# EAGLE design EtnaNode0.2 (EAGLE 7.2.0)
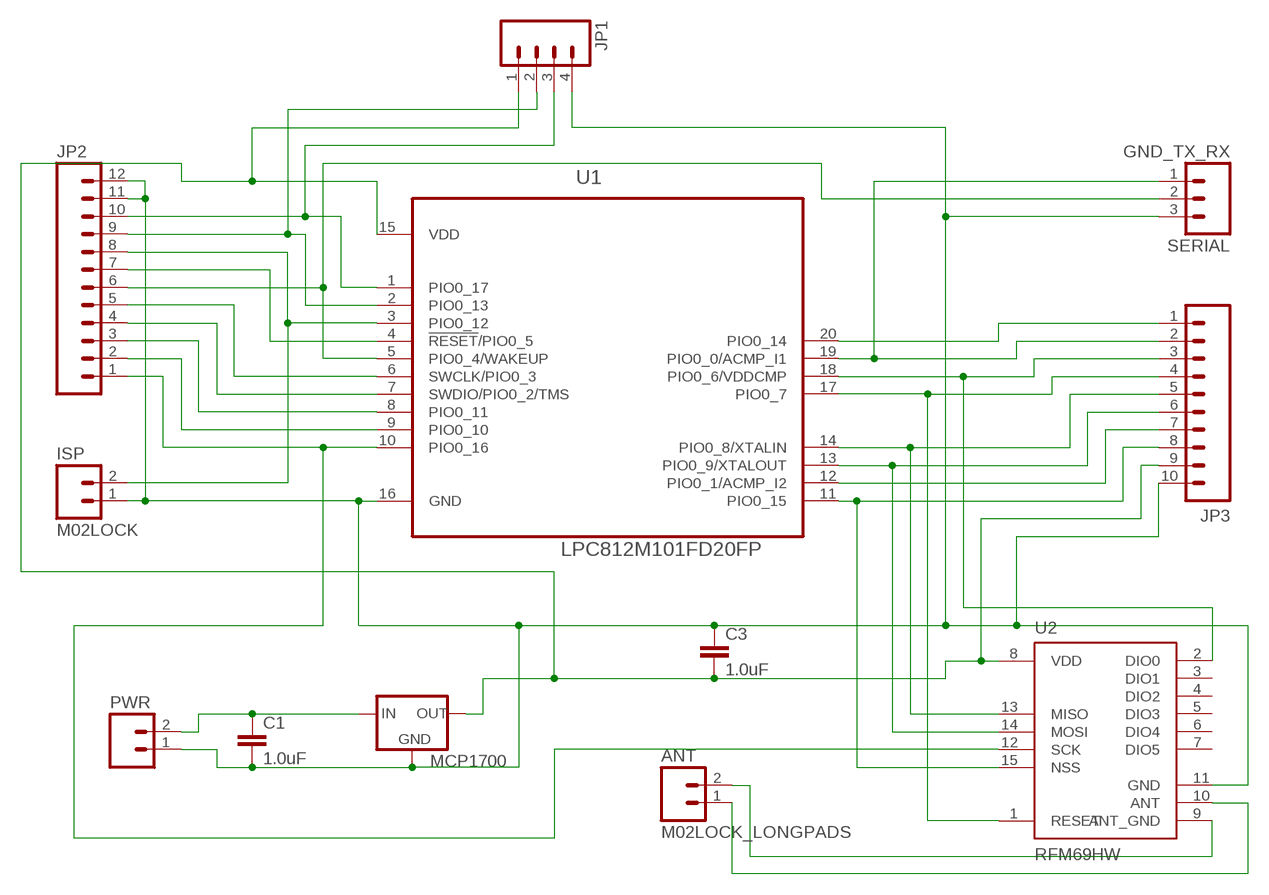
[diagram p0: schematic, sheet 1]

## Parts
ANT  M02LOCK_LONGPADS  [1X02_LOCK_LONGPADS]
C1  1.0uF  CAPPTH  [CAP-PTH-SMALL]
C3  1.0uF  CAPPTH  [CAP-PTH-SMALL]
ISP  M02LOCK  [1X02_LOCK]
JP1  M04LOCK  [1X04_LOCK]
JP2  M12LOCK  [1X12_LOCK]
JP3  M10LOCK  [1X10_LOCK]
MCP1700  MCP1700INLINE  [TO92-INLINE]
PWR  M02LOCK_LONGPADS  [1X02_LOCK_LONGPADS]
SERIAL  GND_TX_RX  M03LOCK  [1X03_LOCK]
U1  LPC812M101FD20FP  [SOIC127P1032X265-20N]
U2  RFM69HW  [RFM69W-XXXS2]

## Nets
ANT_GND: ANT.2 U2.9(ANT_GND)
GND: C1.2 C3.1 ISP.1 JP1.4 JP2.11 JP2.12(VCC) JP3.10 MCP1700.1(GND) PWR.1 SERIAL.3(U0_RXD) U1.16(GND) U2.11(GND)
N$1: C1.1 MCP1700.2(IN) PWR.2
N$4: JP3.2 SERIAL.1(GND) U1.19(PIO0_0/ACMP_I1)
N$5: JP2.6 SERIAL.2(U0_TXD) U1.5(PIO0_4/WAKEUP)
N$6: ISP.2 JP2.8 U1.3(PIO0_12)
N$7: JP3.5 U1.14(PIO0_8/XTALIN) U2.13(MISO)
N$8: JP3.6 U1.13(PIO0_9/XTALOUT) U2.14(MOSI)
N$9: JP3.7 U1.12(PIO0_1/ACMP_I2)
N$10: JP3.8 U1.11(PIO0_15) U2.15(NSS)
N$11: JP3.4 U1.17(PIO0_7) U2.1(RESET)
N$12: JP3.3 U1.18(PIO0_6/VDDCMP) U2.2(DIO0)
N$14: JP2.2 U1.9(PIO0_10)
N$15: JP2.3 U1.8(PIO0_11)
N$16: JP2.4 U1.7(SWDIO/PIO0_2/TMS)
N$17: JP2.5 U1.6(SWCLK/PIO0_3)
N$18: JP2.7 U1.4(!RESET!/PIO0_5)
N$19: JP1.2 JP2.9 U1.2(PIO0_13)
N$20: JP1.3 JP2.10 U1.1(PIO0_17)
N$21: JP3.1 U1.20(PIO0_14)
N$22: ANT.1 U2.10(ANT)
N$23: JP2.1 U1.10(PIO0_16) U2.12(SCK)
VDD: C3.2 JP1.1 JP3.9 MCP1700.3(OUT) U1.15(VDD) U2.8(VDD)
Unconnected: U2.3(DIO1) U2.4(DIO2) U2.5(DIO3) U2.6(DIO4) U2.7(DIO5)

## Library data of the parts
ANT ISP PWR = SparkFun-Connectors:M02: Standard 2-pin 0.1" header. Use with - straight break away headers ( PRT-00116) - right angle break away headers (PRT-00553) - swiss pins (PRT-00743) - machine pins (PRT-00117) - female headers (PRT-00115) Molex polarized connector foot print use with: PRT-08233 with associated crimp pins and housings. 2.54_SCREWTERM for use with PRT-10571. 3.5mm Screw Terminal footprints for PRT-08084 5mm Screw Terminal footprints for use with PRT-08432
C1 C3 = SparkFun-Capacitors:CAP: Capacitor Standard 0603 ceramic capacitor, and 0.1" leaded capacitor.
JP1 = SparkFun-Connectors:M04: Header 4 Standard 4-pin 0.1" header. Use with straight break away headers (SKU : PRT-00116), right angle break away headers (PRT-00553), swiss pins (PRT-00743), machine pins (PRT-00117), and female headers (PRT-00115). Molex polarized connector foot print use with SKU : PRT-08231 with associated crimp pins and housings. 1MM SMD Version SKU: PRT-10208
JP2 = SparkFun-Connectors:M12: Header 12 Standard 12-pin 0.1" header. Use with straight break away headers (SKU : PRT-00116), right angle break away headers (PRT-00553), swiss pins (PRT-00743), machine pins (PRT-00117), and female headers (PRT-00115).
JP3 = SparkFun-Connectors:M10: Header 10 Standard 10-pin 0.1" header. Use with straight break away headers (SKU : PRT-00116), right angle break away headers (PRT-00553), swiss pins (PRT-00743), machine pins (PRT-00117), and female headers (PRT-00115).
MCP1700 = adafruit:MCP1700: VOLTAGE REGULATOR
SERIAL = SparkFun-Connectors:M03: Header 3 Standard 3-pin 0.1" header. Use with straight break away headers (SKU : PRT-00116), right angle break away headers (PRT-00553), swiss pins (PRT-00743), machine pins (PRT-00117), and female headers (PRT-00115). Molex polarized connector foot print use with SKU : PRT-08232 with associated crimp pins and housings.
U1 = lpc812:LPC812M101FD20FP: IC, 32-bit ARM Cortex-M0+ microcontroller 16 kB flash and 4 kB SRAM, SO20; MPN: LPC812M101FD20FP; OC_FARNELL: 2295531; OC_NEWARK: 69W0666; PACKAGE: SO20; SUPPLIER: NXP
U2 = SparkFun-RF:RFM69H

## Board
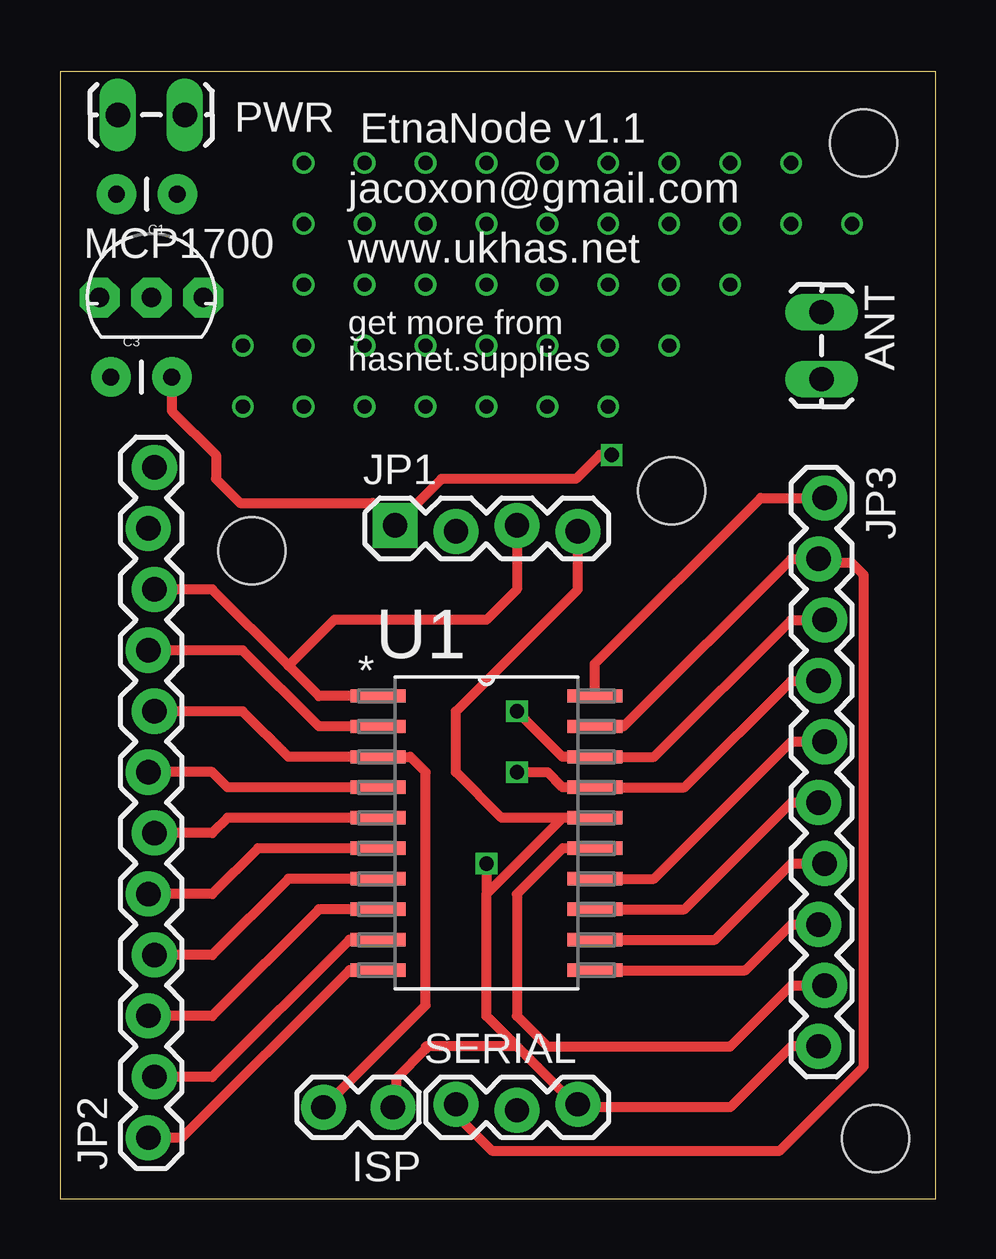
[diagram p1: board, top side]
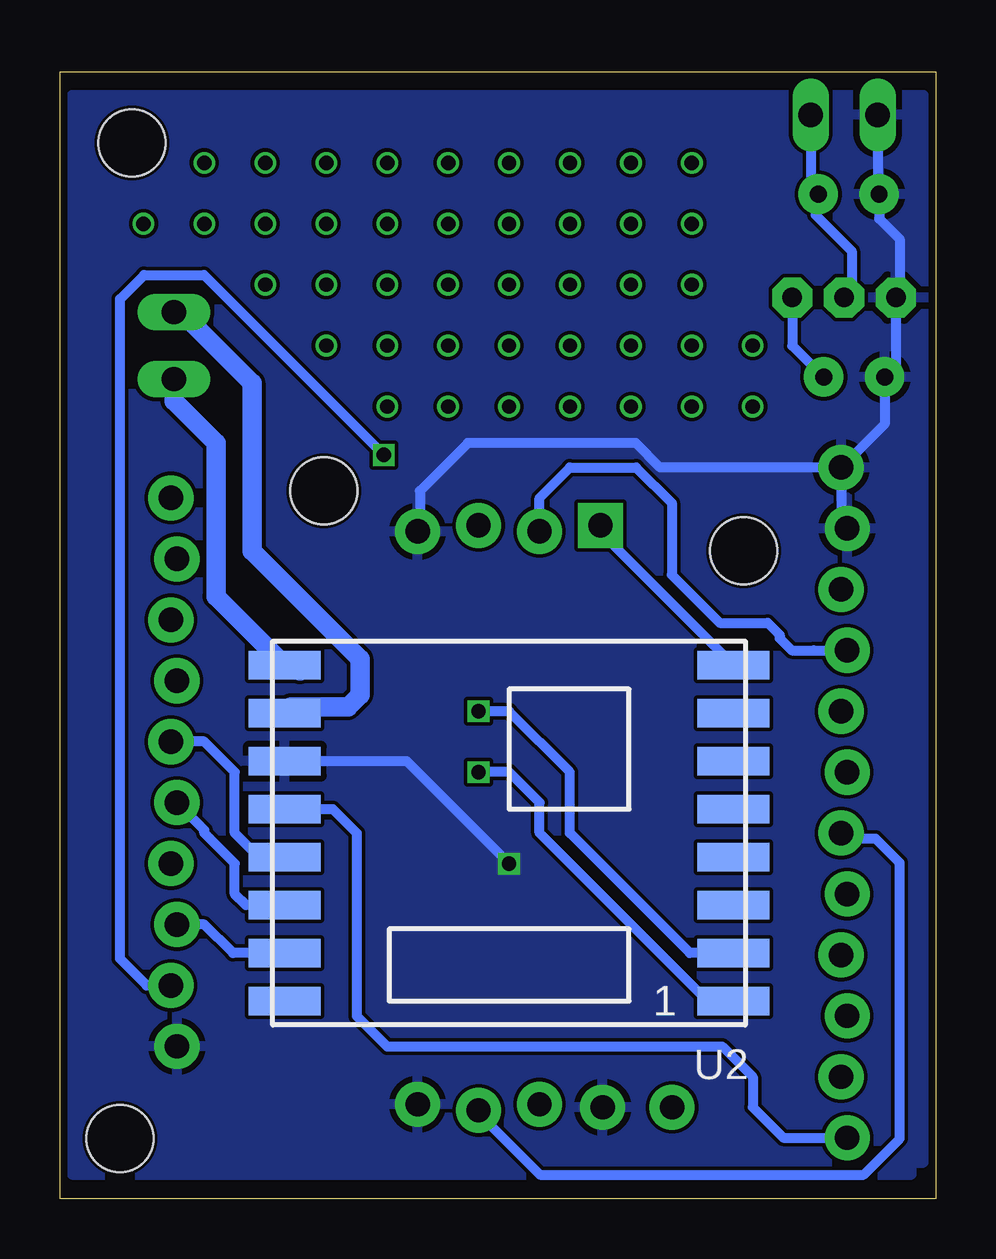
[diagram p2: board, bottom side, seen from below]

Size 36.5 x 46.98 mm. Coordinates in mm from the lower left corner, seen from the top.
Outline: 0,0 36.5,0 36.5,46.98 0,46.98 0,0
Copper layers (1*16): Top 0.035mm / dielectric 1.5mm / Bottom 0.035mm
Design rules "hackvana": minimum track width 6mil, minimum drill 0.3mm, track to track 6mil, track to pad 6mil, pad to pad 6mil, via to via 6mil, smd to smd 0mil, copper to edge 6mil, drill to drill 6mil, minimum pad ring 10mil, minimum via ring 6mil, stop-mask expansion 2mil, vias tented up to drill 100mil, thermal gap 10mil
Holes 2.8 mm at 33.5,44 34,2.5 25.5,29.5 8,27

### Footprints (pad centres in the part's own frame; a part is rotated, then mirrored left to right if it is on the bottom)
1X02_LOCK_LONGPADS = drill 1.016 long: 1 -0.127,0; 2 2.667,0
CAP-PTH-SMALL = drill 0.7 pad 1.651: 1 0,0; 2 2.54,0
1X02_LOCK = drill 1.016 pad 1.88: 1 -0.178,0; 2 2.718,0
1X04_LOCK = drill 1.016 pad 1.88 square: 1 0,0.127 | drill 1.016 pad 1.88: 2 2.54,-0.127; 3 5.08,0.127; 4 7.62,-0.127
1X12_LOCK = drill 1.016 pad 1.88: 1 0,0.127; 2 2.54,-0.127; 3 5.08,0.127; 4 7.62,-0.127; 5 10.16,0.127; 6 12.7,-0.127; 7 15.24,0.127; 8 17.78,-0.127; 9 20.32,0.127; 10 22.86,-0.127; 11 25.4,0.127; 12 27.94,-0.127
1X10_LOCK = drill 1.016 pad 1.88: 1 0,0.127; 2 2.54,-0.127; 3 5.08,0.127; 4 7.62,-0.127; 5 10.16,0.127; 6 12.7,-0.127; 7 15.24,0.127; 8 17.78,-0.127; 9 20.32,0.127; 10 22.86,-0.127
TO92-INLINE = drill 0.813 pad 1.676 octagon: 1 -2.159,0; 2 0,0; 3 2.159,0
1X03_LOCK = drill 1.016 pad 1.88: 1 0,0.127; 2 2.54,-0.127; 3 5.08,0.127
SOIC127P1032X265-20N = smd 2.286 x 0.559: 1 -4.521,5.715; 2 -4.521,4.445; 3 -4.521,3.175; 4 -4.521,1.905; 5 -4.521,0.635; 6 -4.521,-0.635; 7 -4.521,-1.905; 8 -4.521,-3.175; 9 -4.521,-4.445; 10 -4.521,-5.715; 11 4.521,-5.715; 12 4.521,-4.445; 13 4.521,-3.175; 14 4.521,-1.905; 15 4.521,-0.635; 16 4.521,0.635; 17 4.521,1.905; 18 4.521,3.175; 19 4.521,4.445; 20 4.521,5.715
RFM69W-XXXS2 = smd 3 x 1.2: 1 -9.35,7; 2 -9.35,5; 3 -9.35,3; 4 -9.35,1; 5 -9.35,-1; 6 -9.35,-3; 7 -9.35,-5; 8 -9.35,-7; 9 9.35,-7; 10 9.35,-5; 11 9.35,-3; 12 9.35,-1; 13 9.35,1; 14 9.35,3; 15 9.35,5; 16 9.35,7

### Placement (x,y rotation side)
ANT  31.75,36.83 270 top
C1  4.89,41.87 180 top
C3  2.12,34.25 0 top
ISP  13.7,3.81 180 top
JP1  13.97,27.94 0 top
JP2  3.81,2.54 90 top
JP3  31.75,29.21 270 top
MCP1700  3.81,37.56 0 top
PWR  2.54,45.18 0 top
SERIAL  16.51,3.81 0 top
U1  17.78,15.24 0 top
U2  17.78,15.24 180 bottom

### Tracks (layer width: path | path; a pad name or v marks a point on that pad's centre or on a via)
ANT_GND
  Bottom 0.813: 26.5,22 26.74,22.24 U2.9 30,25.11 30,31.5 31.75,33.25 ANT.2
GND  (via drill 0.6)
  Top 0.406: SERIAL.3 21.59,3.81 | U1.16 20.95,15.88 | JP1.4 21.59,25.4 16.51,20.32 16.51,17.78 18.41,15.88 20.95,15.88 | JP3.10 30.48,6.35 27.94,3.81 21.72,3.81 SERIAL.3 | SERIAL.3 21.46,3.94 19.05,6.35 | 19.05,6.35 17.78,7.62 17.78,12.7 | 17.78,12.7 20.95,15.88 | v17.78,13.97 17.78,12.7 | 19.05,6.35 15.24,6.35 15.24,6.24 14,5 14,3.93 ISP.1
  Bottom 0.406: JP2.12 3.94,28.19 JP2.11 | U2.11 22.05,18.24 v17.78,13.97 | PWR.1 2.41,41.93 C1.2 2.35,40.85 1.5,40 1.5,37.71 MCP1700.1 1.65,34.72 C3.1 2.12,32.3 JP2.12 | JP2.12 11.48,30.48 12.5,31.5 19.5,31.5 21.5,29.5 21.5,27.9 JP1.4
  pour Bottom: 1,46 36,46 36,45.5 36,1 1,1 1,1.5 0.5,1.5 0.5,46
N$1
  Bottom 0.406: PWR.2 5.21,42.19 C1.1 4.89,41.89 5,42 5,41 3.5,39.5 3.5,37.87 MCP1700.2
N$2  (via drill 0.6)
  other vias: 25.4,43.18
N$3  (via drill 0.6)
  other vias: 22.86,43.18
N$4
  Top 0.406: U1.19 23.5,19.68 30.48,26.67 JP3.2 31.79,26.5 33,26.5 33.5,26 33.5,5.5 30,2 18,2 16.51,3.49 SERIAL.1
N$5
  Top 0.406: U1.5 6.99,15.88 6.35,15.24 JP2.6
  Bottom 0.406: SERIAL.2 19.05,3.55 16.5,1 3,1 1.5,2.5 1.5,14 2.5,15 4.26,15 4.5,15.24 JP2.6
N$6
  Top 0.406: JP2.8 7.62,20.32 9.53,18.41 U1.3 14.61,18.41 15.24,17.78 15.24,8.07 ISP.2
N$7
  Top 0.406: U1.14 24.77,13.34 30.48,19.05 JP3.5
  Bottom 0.406: U2.13 28.21,14.24 29.21,15.24 29.21,17.78 30.48,19.05 JP3.5
N$8
  Top 0.406: U1.13 26.04,12.06 30.48,16.51 JP3.6
  Bottom 0.406: U2.14 28.75,12.24 29.21,12.7 29.21,13.97 30.48,15.24 30.48,15.37 JP3.6
N$9
  Top 0.406: U1.12 27.3,10.79 30.48,13.97 JP3.7
N$10
  Top 0.406: U1.11 28.57,9.53 30.48,11.43 JP3.8
  Bottom 0.406: U2.15 29.29,10.24 30.48,11.43 JP3.8
N$11  (via drill 0.6)
  Top 0.406: JP3.4 30.48,21.59 26.04,17.14 U1.17 20.95,17.14 20.32,17.78 v19.05,17.78
  Bottom 0.406: U2.1 9.51,8.24 16.51,15.24 16.51,16.51 17.78,17.78 v19.05,17.78
N$12  (via drill 0.6)
  Top 0.406: JP3.3 30.48,24.13 24.77,18.41 U1.18 20.95,18.41 v19.05,20.32
  Bottom 0.406: U2.2 10.24,10.24 15.24,15.24 15.24,17.78 17.78,20.32 v19.05,20.32
N$13  (via drill 0.6)
  other vias: 20.32,43.18
N$14
  Top 0.406: U1.9 12.06,10.79 6.35,5.08 JP2.2
N$15
  Top 0.406: U1.8 10.79,12.06 6.35,7.62 JP2.3
N$16
  Top 0.406: U1.7 9.53,13.34 6.35,10.16 JP2.4
N$17
  Top 0.406: U1.6 8.26,14.61 6.35,12.7 JP2.5
N$18
  Top 0.406: U1.4 6.99,17.14 6.35,17.78 JP2.7
N$19
  Top 0.406: U1.2 10.79,19.68 7.62,22.86 JP2.9
  Bottom 0.406: JP1.2 16.51,29.21 15.24,30.48 12.48,30.48 11,29 11,26 9,24 7,24 6.5,23.5 6.5,23.36 6,22.86 JP2.9 5.08,22.86
N$20
  Top 0.406: U1.1 10.79,20.95 9.53,22.23 | 9.53,22.23 6.35,25.4 JP2.10 | JP1.3 19.05,25.4 17.78,24.13 11.43,24.13 9.53,22.23
N$21
  Top 0.406: U1.20 22.3,22.3 29.21,29.21 JP3.1
N$22
  Bottom 0.813: ANT.1 31.46,36.96 28.5,34 28.5,27 24,22.5 24,21 24.5,20.5 26.87,20.5 U2.10
N$23
  Top 0.406: U1.10 12.06,9.53 5.08,2.54 JP2.1
  Bottom 0.406: U2.12 25.13,16.24 24.13,15.24 24.13,7.62 22.86,6.35 8.89,6.35 7.62,5.08 7.62,3.81 6.35,2.54 JP2.1
N$24  (via drill 0.6)
  other vias: 17.78,43.18
N$25  (via drill 0.6)
  other vias: 15.24,43.18
N$26  (via drill 0.6)
  other vias: 12.7,43.18
N$27  (via drill 0.6)
  other vias: 10.16,43.18
N$28  (via drill 0.6)
  other vias: 10.16,40.64
N$29  (via drill 0.6)
  other vias: 12.7,40.64
N$30  (via drill 0.6)
  other vias: 15.24,40.64
N$31  (via drill 0.6)
  other vias: 17.78,40.64
N$32  (via drill 0.6)
  other vias: 20.32,40.64
N$33  (via drill 0.6)
  other vias: 22.86,40.64
N$34  (via drill 0.6)
  other vias: 25.4,40.64
N$35  (via drill 0.6)
  other vias: 25.4,38.1
N$36  (via drill 0.6)
  other vias: 22.86,38.1
N$37  (via drill 0.6)
  other vias: 20.32,38.1
N$38  (via drill 0.6)
  other vias: 17.78,38.1
N$39  (via drill 0.6)
  other vias: 15.24,38.1
N$40  (via drill 0.6)
  other vias: 12.7,38.1
N$41  (via drill 0.6)
  other vias: 10.16,38.1
N$42  (via drill 0.6)
  other vias: 10.16,35.56
N$43  (via drill 0.6)
  other vias: 12.7,35.56
N$44  (via drill 0.6)
  other vias: 15.24,35.56
N$45  (via drill 0.6)
  other vias: 17.78,35.56
N$46  (via drill 0.6)
  other vias: 20.32,35.56
N$47  (via drill 0.6)
  other vias: 22.86,35.56
N$48  (via drill 0.6)
  other vias: 25.4,35.56
N$49  (via drill 0.6)
  other vias: 20.32,33.02
N$50  (via drill 0.6)
  other vias: 17.78,33.02
N$51  (via drill 0.6)
  other vias: 15.24,33.02
N$52  (via drill 0.6)
  other vias: 12.7,33.02
N$53  (via drill 0.6)
  other vias: 10.16,33.02
N$54  (via drill 0.6)
  other vias: 7.62,35.56
N$55  (via drill 0.6)
  other vias: 7.62,33.02
N$56  (via drill 0.6)
  other vias: 22.86,33.02
N$57  (via drill 0.6)
  other vias: 27.94,38.1
N$58  (via drill 0.6)
  other vias: 27.94,40.64
N$59  (via drill 0.6)
  other vias: 27.94,43.18
N$60  (via drill 0.6)
  other vias: 30.48,43.18
N$61  (via drill 0.6)
  other vias: 30.48,40.64
N$62  (via drill 0.6)
  other vias: 33.02,40.64
VDD  (via drill 0.6)
  Top 0.406: U1.15 20.95,14.61 19.05,12.7 19.05,7.62 20.32,6.35 27.94,6.35 30.48,8.89 JP3.9 | C3.2 4.66,32.84 6.5,31 6.5,30 7.5,29 13.04,29 JP1.1 15.9,30 21.5,30 22.5,31 v23,31
  Bottom 0.406: JP1.1 13.97,27.78 U2.8 | MCP1700.3 5.97,35.56 C3.2 | JP3.9 32.89,8.89 34,10 34,37.5 33,38.5 30.5,38.5 v23,31

### Text on the board
tPlace: EtnaNode v1.1 | jacoxon@gmail.com | www.ukhas.net | get more from / hasnet.supplies